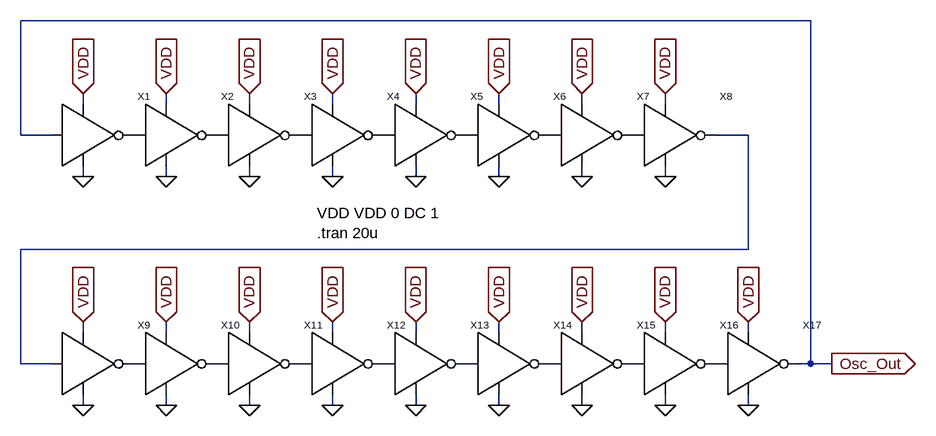
[diagram p0: schematic Ring_Oscillator.asc]
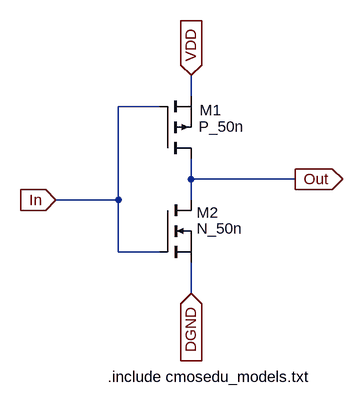
[diagram p1: sub-circuit inverter.asc]
Ring_Oscillator.asc, the LTspice schematic file:
Version 4
SHEET 1 1024 680
WIRE 752 -736 -464 -736
WIRE -368 -608 -368 -624
WIRE -240 -608 -240 -624
WIRE -112 -608 -112 -624
WIRE 16 -608 16 -624
WIRE 144 -608 144 -624
WIRE 272 -608 272 -624
WIRE 400 -608 400 -624
WIRE 528 -608 528 -624
WIRE -464 -560 -464 -736
WIRE -416 -560 -464 -560
WIRE 656 -560 608 -560
WIRE -368 -496 -368 -512
WIRE -240 -496 -240 -512
WIRE -112 -496 -112 -512
WIRE 16 -496 16 -512
WIRE 144 -496 144 -512
WIRE 272 -496 272 -512
WIRE 400 -496 400 -512
WIRE 528 -496 528 -512
WIRE 656 -384 656 -560
WIRE 656 -384 -464 -384
WIRE -368 -256 -368 -272
WIRE -240 -256 -240 -272
WIRE -112 -256 -112 -272
WIRE 16 -256 16 -272
WIRE 144 -256 144 -272
WIRE 272 -256 272 -272
WIRE 400 -256 400 -272
WIRE 528 -256 528 -272
WIRE 656 -256 656 -272
WIRE -464 -208 -464 -384
WIRE -416 -208 -464 -208
WIRE 752 -208 752 -736
WIRE 752 -208 736 -208
WIRE 784 -208 752 -208
WIRE -368 -144 -368 -160
WIRE -240 -144 -240 -160
WIRE -112 -144 -112 -160
WIRE 16 -144 16 -160
WIRE 144 -144 144 -160
WIRE 272 -144 272 -160
WIRE 400 -144 400 -160
WIRE 528 -144 528 -160
WIRE 656 -144 656 -160
FLAG -368 -496 0
FLAG -368 -624 VDD
IOPIN -368 -624 In
FLAG 784 -208 Osc_Out
IOPIN 784 -208 Out
FLAG -240 -496 0
FLAG -240 -624 VDD
IOPIN -240 -624 In
FLAG -112 -496 0
FLAG -112 -624 VDD
IOPIN -112 -624 In
FLAG 16 -496 0
FLAG 16 -624 VDD
IOPIN 16 -624 In
FLAG 144 -496 0
FLAG 144 -624 VDD
IOPIN 144 -624 In
FLAG 272 -496 0
FLAG 272 -624 VDD
IOPIN 272 -624 In
FLAG 400 -496 0
FLAG 400 -624 VDD
IOPIN 400 -624 In
FLAG 528 -496 0
FLAG 528 -624 VDD
IOPIN 528 -624 In
FLAG -368 -144 0
FLAG -368 -272 VDD
IOPIN -368 -272 In
FLAG -240 -144 0
FLAG -240 -272 VDD
IOPIN -240 -272 In
FLAG -112 -144 0
FLAG -112 -272 VDD
IOPIN -112 -272 In
FLAG 16 -144 0
FLAG 16 -272 VDD
IOPIN 16 -272 In
FLAG 144 -144 0
FLAG 144 -272 VDD
IOPIN 144 -272 In
FLAG 272 -144 0
FLAG 272 -272 VDD
IOPIN 272 -272 In
FLAG 400 -144 0
FLAG 400 -272 VDD
IOPIN 400 -272 In
FLAG 528 -144 0
FLAG 528 -272 VDD
IOPIN 528 -272 In
FLAG 656 -144 0
FLAG 656 -272 VDD
IOPIN 656 -272 In
SYMBOL Inverter -400 -560 R0
SYMATTR InstName X1
SYMBOL Inverter -272 -560 R0
SYMATTR InstName X2
SYMBOL Inverter -144 -560 R0
SYMATTR InstName X3
SYMBOL Inverter -16 -560 R0
SYMATTR InstName X4
SYMBOL Inverter 112 -560 R0
SYMATTR InstName X5
SYMBOL Inverter 240 -560 R0
SYMATTR InstName X6
SYMBOL Inverter 368 -560 R0
SYMATTR InstName X7
SYMBOL Inverter 496 -560 R0
SYMATTR InstName X8
SYMBOL Inverter -400 -208 R0
SYMATTR InstName X9
SYMBOL Inverter -272 -208 R0
SYMATTR InstName X10
SYMBOL Inverter -144 -208 R0
SYMATTR InstName X11
SYMBOL Inverter -16 -208 R0
SYMATTR InstName X12
SYMBOL Inverter 112 -208 R0
SYMATTR InstName X13
SYMBOL Inverter 240 -208 R0
SYMATTR InstName X14
SYMBOL Inverter 368 -208 R0
SYMATTR InstName X15
SYMBOL Inverter 496 -208 R0
SYMATTR InstName X16
SYMBOL Inverter 624 -208 R0
SYMATTR InstName X17
TEXT -8 -440 Left 2 !VDD VDD 0 DC 1\n.tran 20u

inverter.asc, the sub-circuit schematic file:
Version 4
SHEET 1 1024 680
WIRE 128 -672 128 -704
WIRE 80 -656 16 -656
WIRE 128 -544 128 -576
WIRE 288 -544 128 -544
WIRE 16 -512 16 -656
WIRE 16 -512 -80 -512
WIRE 128 -512 128 -544
WIRE 16 -432 16 -512
WIRE 80 -432 16 -432
WIRE 128 -368 128 -416
FLAG 288 -544 Out
IOPIN 288 -544 Out
FLAG 128 -704 VDD
IOPIN 128 -704 In
FLAG -80 -512 In
IOPIN -80 -512 In
FLAG 128 -368 DGND
IOPIN 128 -368 In
SYMBOL nmos 80 -512 R0
WINDOW 3 57 44 Left 2
WINDOW 0 57 19 Left 2
SYMATTR Value N_50n
SYMATTR InstName M2
SYMBOL pmos 80 -576 M180
WINDOW 3 60 49 Left 2
WINDOW 0 61 74 Left 2
SYMATTR Value P_50n
SYMATTR InstName M1
TEXT 0 -240 Left 2 !.include cmosedu_models.txt

The netlist it stands for:
* Ring_Oscillator.asc
XX1 Osc_Out VDD 0 P001 inverter
XX2 P001 VDD 0 P002 inverter
XX3 P002 VDD 0 P003 inverter
XX4 P003 VDD 0 P004 inverter
XX5 P004 VDD 0 P005 inverter
XX6 P005 VDD 0 P006 inverter
XX7 P006 VDD 0 P007 inverter
XX8 P007 VDD 0 N001 inverter
XX9 N001 VDD 0 P008 inverter
XX10 P008 VDD 0 P009 inverter
XX11 P009 VDD 0 P010 inverter
XX12 P010 VDD 0 P011 inverter
XX13 P011 VDD 0 P012 inverter
XX14 P012 VDD 0 P013 inverter
XX15 P013 VDD 0 P014 inverter
XX16 P014 VDD 0 P015 inverter
XX17 P015 VDD 0 Osc_Out inverter

* block symbol definitions
.subckt inverter In VDD DGND Out
M2 Out In DGND DGND N_50n
M1 Out In VDD VDD P_50n
.include cmosedu_models.txt
.ends inverter

.model NMOS NMOS
.model PMOS PMOS
.lib standard.mos
VDD VDD 0 DC 1
.tran 20u
.backanno
.end